# Altium schematic sheet sch.SchDoc
size A4
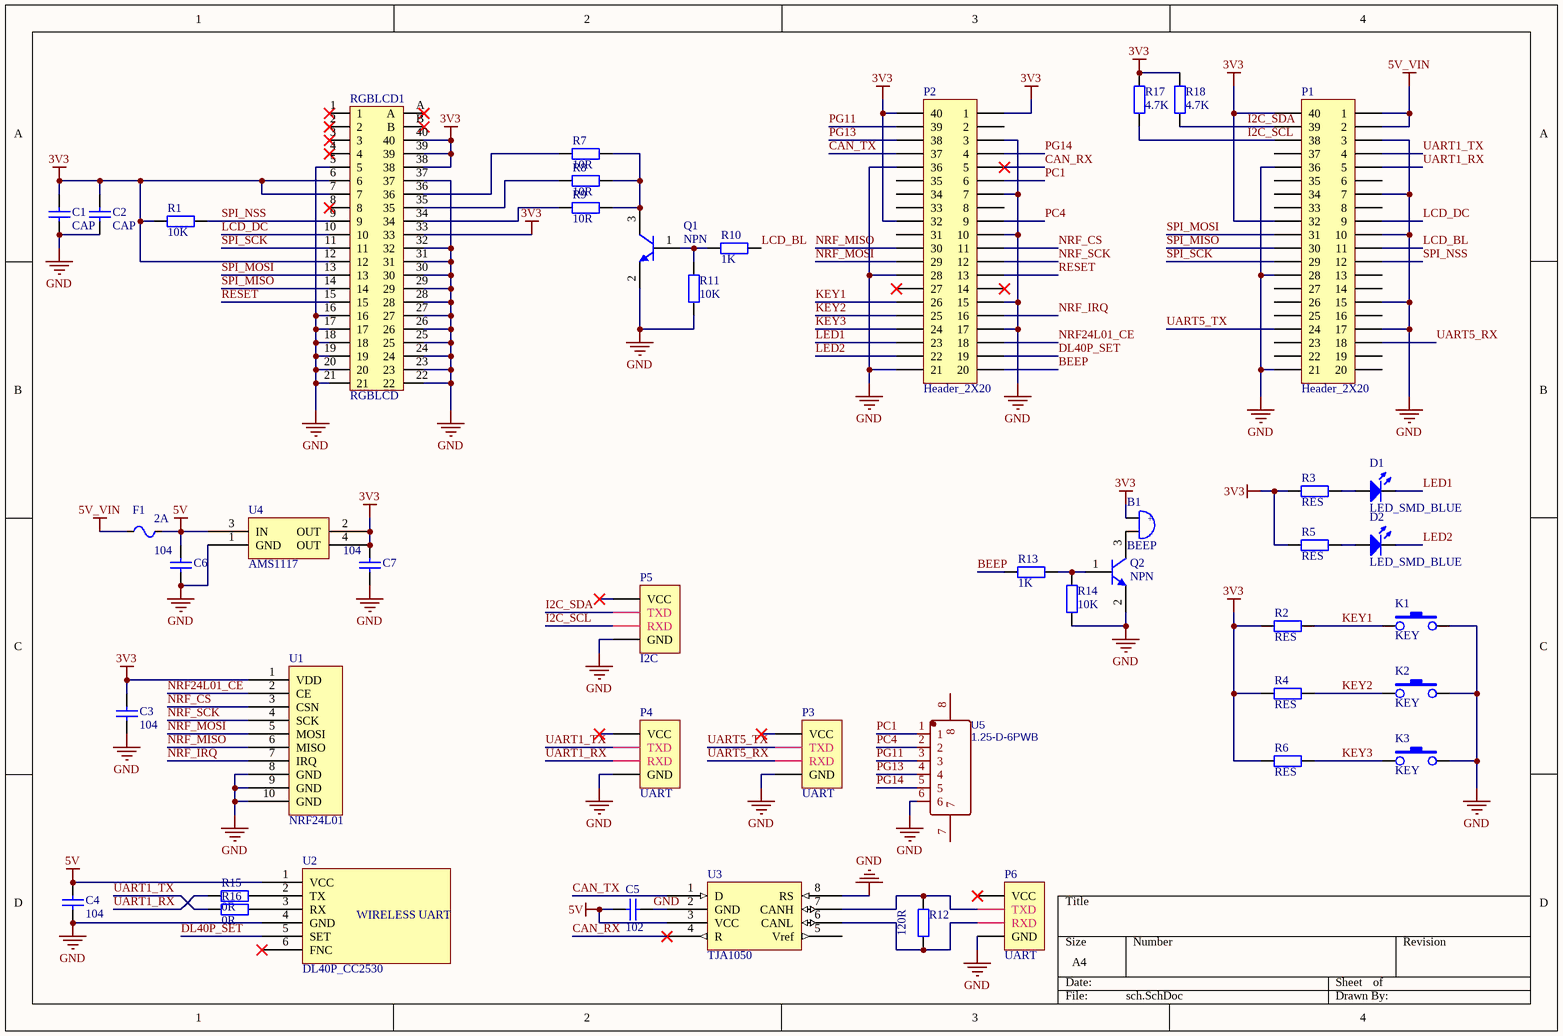
[diagram p0: sch.SchDoc]

## Parts
B1  BEEP  [BEEP 5x9x5.5]
C1  CAP  [Cap-0603]
C2  CAP  [Cap-0603]
C3  104  [Cap-0603]
C4  104  [Cap-0603]
C5  102  [Cap-0603]
C6  104  [Cap-0603]
C7  104  [Cap-0603]
D1  LED_SMD_BLUE  [LED_0603_B]
D2  LED_SMD_BLUE  [LED_0603_B]
F1  2A  [FU 1206]
K1  KEY  [SW-SMD-2X4]
K2  KEY  [SW-SMD-2X4]
K3  KEY  [SW-SMD-2X4]
P1  Header_2X20  [Header 2.54_2X20]
P2  Header_2X20  [Header 2.54_2X20]
P3  UART  [SMT1.25_4P-90]
P4  UART  [SMT1.25_4P-90]
P5  I2C  [SMT1.25_4P-90]
P6  UART  [SMT1.25_4P-90]
Q1  NPN  [SOT23-3]
Q2  NPN  [SOT23-3]
R1  10K  [Res-0603]
R2  RES  [Res-0603]
R3  RES  [Res-0603]
R4  RES  [Res-0603]
R5  RES  [Res-0603]
R6  RES  [Res-0603]
R7  10R  [Res-0603]
R8  10R  [Res-0603]
R9  10R  [Res-0603]
R10  1K  [Res-0603]
R11  10K  [Res-0603]
R12  120R  [Res-0603]
R13  1K  [Res-0603]
R14  10K  [Res-0603]
R15  0R  [Res-0603]
R16  0R  [Res-0603]
R17  4.7K  [Res-0603]
R18  4.7K  [Res-0603]
RGBLCD1  RGBLCD  [FPC0.5-TOP40P]
U1  NRF24L01  [PE01-ML01SP4]
U2  DL40P_CC2530  [DL43P_CC2530]
U3  TJA1050  [SOP8_N]
U4  AMS1117  [AMS1117]
U5  1.25-D-6PWB  [SMT1.25_6P-90]

## Nets
3V3: B1.1 C1.2 C2.2 C3.2 C7.1 P1.32 P1.40 P2.1 P2.32 P2.40 R1.1 R2.1 R3.1 R4.1 R5.1 R6.1 R17.2 R18.2 RGBLCD1.6 RGBLCD1.7 RGBLCD1.12 RGBLCD1.33 RGBLCD1.38 RGBLCD1.39 RGBLCD1.40 U1.1(VDD) U4.2(OUT) U4.4(OUT)
5V: C4.2 C5.1 C6.1 F1.2 U2.1(VCC) U3.3(VCC) U4.3(IN)
5V_VIN: F1.1 P1.1 P1.2
GND: C1.1 C2.1 C3.1 C4.1 C5.2 C6.2 C7.2 K1.3 K2.3 K3.3 P1.3 P1.7 P1.10 P1.15 P1.17 P1.21 P1.28 P1.36 P2.3 P2.7 P2.10 P2.15 P2.17 P2.21 P2.28 P2.36 P3.4(GND) P4.4(GND) P5.4(GND) P6.4(GND) Q1.2(E) Q2.2(E) R11.1 R14.1 RGBLCD1.5 RGBLCD1.16 RGBLCD1.17 RGBLCD1.18 RGBLCD1.19 RGBLCD1.20 RGBLCD1.21 RGBLCD1.22 RGBLCD1.23 RGBLCD1.24 RGBLCD1.25 RGBLCD1.26 RGBLCD1.27 RGBLCD1.28 RGBLCD1.29 RGBLCD1.30 RGBLCD1.31 RGBLCD1.32 RGBLCD1.37 U1.8(GND) U1.9(GND) U1.10(GND) U2.4(GND) U3.2(GND) U3.8(RS) U4.1(GND) U5.6
BEEP: P2.20 R13.2
CAN_RX: P2.5 U3.4(R)
CAN_TX: P2.37 U3.1(D)
DL40P_SET: P2.19 U2.5(SET)
I2C_SCL: P1.38 P5.3(RXD) R17.1
I2C_SDA: P1.39 P5.2(TXD) R18.1
KEY1: K1.1 P2.26 R2.2
KEY2: K2.1 P2.25 R4.2
KEY3: K3.1 P2.24 R6.2
LCD_BL: P1.11 R10.1
LCD_DC: P1.9 RGBLCD1.10
LED1: D1.2(K) P2.23
LED2: D2.2(K) P2.22
NRF24L01_CE: P2.18 U1.2(CE)
NRF_CS: P2.11 U1.3(CSN)
NRF_IRQ: P2.16 U1.7(IRQ)
NRF_MISO: P2.30 U1.6(MISO)
NRF_MOSI: P2.29 U1.5(MOSI)
NRF_SCK: P2.12 U1.4(SCK)
PC1: P2.6 U5.1
PC4: P2.9 U5.2
PG11: P2.39 U5.3
PG13: P2.38 U5.4
PG14: P2.4 U5.5
RESET: P2.13 RGBLCD1.15
SPI_MISO: P1.30 RGBLCD1.14
SPI_MOSI: P1.31 RGBLCD1.13
SPI_NSS: P1.12 R1.2 RGBLCD1.9
SPI_SCK: P1.29 RGBLCD1.11
UART1_RX: P1.5 P4.3(RXD) R15.2
UART1_TX: P1.4 P4.2(TXD) R16.2
UART5_RX: P1.18 P3.3(RXD)
UART5_TX: P1.24 P3.2(TXD)
NetB1_2: B1.2 Q2.3(C)
NetD1_1: D1.1(A) R3.2
NetD2_1: D2.1(A) R5.2
NetP6_2: P6.2(TXD) R12.2 U3.7(CANH)
NetP6_3: P6.3(RXD) R12.1 U3.6(CANL)
NetQ1_1: Q1.1(B) R10.2 R11.2
NetQ1_3: Q1.3(C) R7.1 R8.1 R9.1
NetQ2_1: Q2.1(B) R13.1 R14.2
NetR7_2: R7.2 RGBLCD1.36
NetR8_2: R8.2 RGBLCD1.35
NetR9_2: R9.2 RGBLCD1.34
NetR15_1: R15.1 U2.2(TX)
NetR16_1: R16.1 U2.3(RX)

Not connected (* = marked no-connect by the designer): P1 6 8 13 14 16 19 20 22 23 25 26 27 33 34 35 37; P2 2 8 14* 27* 31 33 34 35; P3 1(VCC)*; P4 1(VCC)*; P5 1(VCC)*; P6 1(VCC)*; RGBLCD1 1* 2* 3* 4* 8* A* B*; U2 6(FNC)*; U3 5(Vref); U5 7 8

## Notes on the sheet
- (in symbol BEEP) +
- (in symbol DL40P_CC2530) WIRELESS UART

## Library data of the parts
B1 = BEEP: 蜂鸣器
C1-C7 = CAP: 贴片陶瓷电容
D1 D2 = LED_SMD_BLUE: 发光二极管; ComponentLink1Description: 供应商链接; ComponentLink1URL: http://www.szlcsc.com/product/details_73150.html; Package: 0603; Supplier: LC; SuppliersPartNumber: C72041
F1 = FU: 贴片保险丝; 版权归属: 源创客; BOM名称: 贴片保险丝; 学习资源: www.ooocke.com
P3-P6 = UART port: LatestRevisionDate: 17-Jul-2002; LatestRevisionNote: Re-released for DXP Platform.; Publisher: Altium Limited
Q1 Q2 = NPN1: 贴片三极管; Published: 8-Jun-2000; LatestRevisionDate: 15-Jan-2003; LatestRevisionNote: PCB Footprint 'BCY-W3/D4.7' replaced; DatasheetDocument: 1997; PackageDocument: Sep-1998; PackageReference: TO-92A; Publisher: Altium Limited; Code_JEDEC: TO-92A; ComponentLink1Description: Manufacturer Link; ComponentLink1URL: http://www.fairchildsemi.com/; ComponentLink2Description: Datasheet; ComponentLink2URL: http://www.fairchildsemi.com/ds/2N%2F2N3904.pdf
R1-R18 = RES: 贴片电阻
RGBLCD1 = FPC-40: FPC-40P-0.5mm
U3 = SN65HVD230D
U5 = 1.25-D-6PWB: BOM_Manufacturer: JUSHUO; Contributor: LCSC; BOM_Supplier: LCSC; BOM_Supplier Part: C35040; BOM_Manufacturer Part: 1.25-D-6PWB; spicePre: U; spiceSymbolName: 1.25-D-6PWB